# EAGLE design Lattice (EAGLE 6.4)
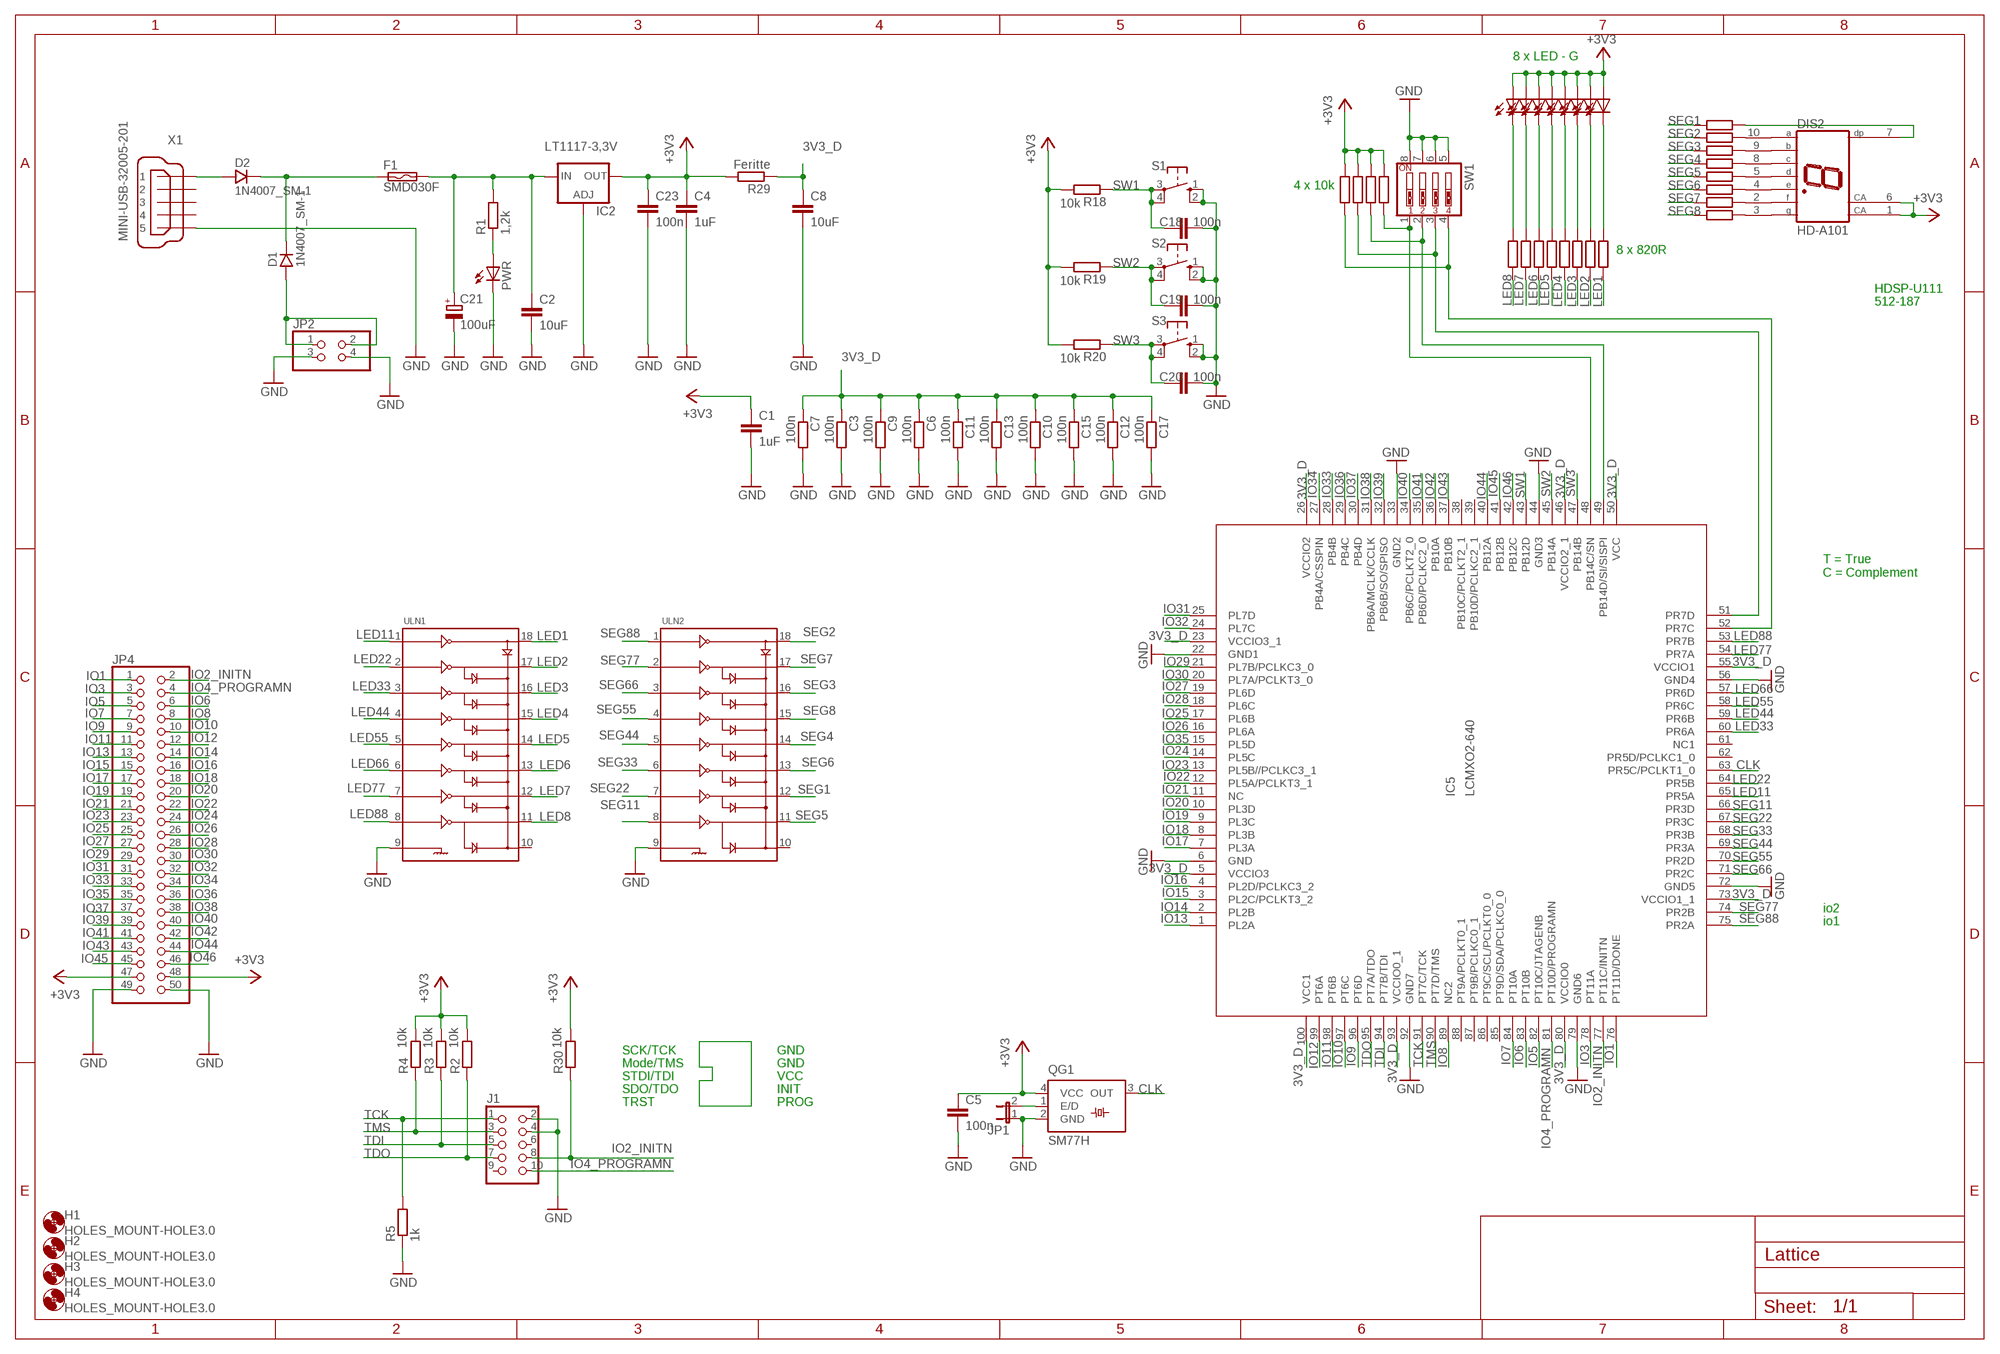
[diagram p0: schematic, sheet 1]

## Parts
C1  1uF  C-EUC1206  [C1206]
C2  10uF  C-EUC1206  [C1206]
C3  100n  R-EU_R0603  [R0603]
C4  1uF  C-EUC1206  [C1206]
C5  100n  C-EUC0805  [C0805]
C6  100n  R-EU_R0603  [R0603]
C7  100n  R-EU_R0603  [R0603]
C8  10uF  C-EUC1206  [C1206]
C9  100n  R-EU_R0603  [R0603]
C10  100n  R-EU_R0603  [R0603]
C11  100n  R-EU_R0603  [R0603]
C12  100n  R-EU_R0603  [R0603]
C13  100n  R-EU_R0603  [R0603]
C15  100n  R-EU_R0603  [R0603]
C17  100n  R-EU_R0603  [R0603]
C18  100n  C-EUC0805  [C0805]
C19  100n  C-EUC0805  [C0805]
C20  100n  C-EUC0805  [C0805]
C21  100uF  CPOL-EU153CLV-0605  [153CLV-0605]
C23  100n  C-EUC0805  [C0805]
D1  1N4007_SM-1  [SM-1]
D2  1N4007_SM-1  [SM-1]
DIS2  HD-A101  [HDSP-A]
F1  SMD030F  [SMD050F]
H1  HOLES_MOUNT-HOLE3.0  [HOLES_3,0]
H2  HOLES_MOUNT-HOLE3.0  [HOLES_3,0]
H3  HOLES_MOUNT-HOLE3.0  [HOLES_3,0]
H4  HOLES_MOUNT-HOLE3.0  [HOLES_3,0]
IC2  LT1117-3,3V  LD117AS50TR  [SOT223]
IC5  LCMXO2-640  LXMXO2-640  [LCMX02-640]
J1  CON_HEADER_2X05-PTH+SHROUDED_A  [PINSHRD_PTH_2X05]
JP1  JP1E  [JP1]
JP2  PINHD-2X2  [2X02]
JP4  PINHD-2X25  [2X25]
LED1  LEDSMT1206  [1206]
LED2  LEDSMT1206  [1206]
LED3  LEDSMT1206  [1206]
LED4  LEDSMT1206  [1206]
LED5  LEDSMT1206  [1206]
LED6  LEDSMT1206  [1206]
LED7  LEDSMT1206  [1206]
LED8  LEDSMT1206  [1206]
PWR  LEDSMT1206  [1206]
QG1  SM77H  [SM77H]
R1  1,2k  R-EU_R0805  [R0805]
R2  10k  R-EU_R0805  [R0805]
R3  10k  R-EU_R0805  [R0805]
R4  10k  R-EU_R0805  [R0805]
R5  1k  R-EU_R0805  [R0805]
R6  R-EU_R0805  [R0805]
R7  R-EU_R0805  [R0805]
R8  R-EU_R0805  [R0805]
R9  R-EU_R0805  [R0805]
R10  R-EU_R0805  [R0805]
R11  R-EU_R0805  [R0805]
R12  R-EU_R0805  [R0805]
R13  R-EU_R0805  [R0805]
R14  R-EU_R0805  [R0805]
R15  R-EU_R0805  [R0805]
R16  R-EU_R0805  [R0805]
R17  R-EU_R0805  [R0805]
R18  10k  R-EU_R0805  [R0805]
R19  10k  R-EU_R0805  [R0805]
R20  10k  R-EU_R0805  [R0805]
R21  R-EU_R0805  [R0805]
R22  R-EU_R0805  [R0805]
R23  R-EU_R0805  [R0805]
R24  R-EU_R0805  [R0805]
R25  R-EU_R0805  [R0805]
R26  R-EU_R0805  [R0805]
R27  R-EU_R0805  [R0805]
R28  R-EU_R0805  [R0805]
R29  Feritte  R-EU_R0805  [R0805]
R30  10k  R-EU_R0805  [R0805]
S1  10-XX  [B3F-10XX]
S2  10-XX  [B3F-10XX]
S3  10-XX  [B3F-10XX]
SW1  SW_DIP-4  [EDG-04]
ULN1  ULN2803SOIC  [SO018]
ULN2  ULN2803SOIC  [SO018]
X1  MINI-USB-32005-201  [32005-201]

## Nets
3V3_D: C3.1 C6.1 C7.1 C8.1 C9.1 C10.1 C11.1 C12.1 C13.1 C15.1 C17.1 IC5.5(VCCIO3) IC5.23(VCCIO3_1) IC5.26(VCCIO2) IC5.46(VCCIO2_1) IC5.50(VCC) IC5.55(VCCIO1) IC5.73(VCCIO1_1) IC5.80(VCCIO0) IC5.93(VCCIO0_1) IC5.100(VCC1) R29.1
+3V3: C1.1 C4.1 C5.1 C23.1 DIS2.1(CA) DIS2.6(CA) IC2.4(OUT) JP4.47 JP4.48 LED1.A LED2.A LED3.A LED4.A LED5.A LED6.A LED7.A LED8.A QG1.4(VCC) R2.2 R3.2 R4.2 R14.1 R15.1 R16.1 R17.1 R18.2 R19.2 R20.2 R29.2 R30.2
CLK: IC5.63(PR5C/PCLKT1_0) QG1.3(OUT)
GND: C1.2 C2.2 C3.2 C4.2 C5.2 C6.2 C7.2 C8.2 C9.2 C10.2 C11.2 C12.2 C13.2 C15.2 C17.2 C18.2 C19.2 C20.2 C21.- C23.2 IC2.1(ADJ) IC5.6(GND) IC5.22(GND1) IC5.33(GND2) IC5.44(GND3) IC5.56(GND4) IC5.72(GND5) IC5.79(GND6) IC5.92(GND7) J1.2 J1.4 JP1.1 JP2.3 JP2.4 JP4.49 JP4.50 PWR.C QG1.2(GND) R5.1 S1.1(S) S1.2(S1) S2.1(S) S2.2(S1) S3.1(S) S3.2(S1) SW1.5 SW1.6 SW1.7 SW1.8 ULN1.9 ULN2.9 X1.5
IO1: IC5.76(PT11D/DONE) JP4.1
IO2_INITN: IC5.77(PT11C/INITN) J1.8 JP4.2 R30.1
IO3: IC5.78(PT11A) JP4.3
IO4_PROGRAMN: IC5.81(PT10D/PROGRAMN) J1.10 JP4.4
IO5: IC5.82(PT10C/JTAGENB) JP4.5
IO6: IC5.83(PT10B) JP4.6
IO7: IC5.84(PT10A) JP4.7
IO8: IC5.89(NC2) JP4.8
IO9: IC5.96(PT6D) JP4.9
IO10: IC5.97(PT6C) JP4.10
IO11: IC5.98(PT6B) JP4.11
IO12: IC5.99(PT6A) JP4.12
IO13: IC5.1(PL2A) JP4.13
IO14: IC5.2(PL2B) JP4.14
IO15: IC5.3(PL2C/PCLKT3_2) JP4.15
IO16: IC5.4(PL2D/PCLKC3_2) JP4.16
IO17: IC5.7(PL3A) JP4.17
IO18: IC5.8(PL3B) JP4.18
IO19: IC5.9(PL3C) JP4.19
IO20: IC5.10(PL3D) JP4.20
IO21: IC5.11(NC) JP4.21
IO22: IC5.12(PL5A/PCLKT3_1) JP4.22
IO23: IC5.13(PL5B//PCLKC3_1) JP4.23
IO24: IC5.14(PL5C) JP4.24
IO25: IC5.17(PL6B) JP4.25
IO26: IC5.16(PL6A) JP4.26
IO27: IC5.19(PL6D) JP4.27
IO28: IC5.18(PL6C) JP4.28
IO29: IC5.21(PL7B/PCLKC3_0) JP4.29
IO30: IC5.20(PL7A/PCLKT3_0) JP4.30
IO31: IC5.25(PL7D) JP4.31
IO32: IC5.24(PL7C) JP4.32
IO33: IC5.28(PB4B) JP4.33
IO34: IC5.27(PB4A/CSSPIN) JP4.34
IO35: IC5.15(PL5D) JP4.35
IO36: IC5.29(PB4C) JP4.36
IO37: IC5.30(PB4D) JP4.37
IO38: IC5.31(PB6A/MCLK/CCLK) JP4.38
IO39: IC5.32(PB6B/SO/SPISO) JP4.39
IO40: IC5.34(PB6C/PCLKT2_0) JP4.40
IO41: IC5.35(PB6D/PCLKC2_0) JP4.41
IO42: IC5.36(PB10A) JP4.42
IO43: IC5.37(PB10B) JP4.43
IO44: IC5.40(PB12A) JP4.44
IO45: IC5.41(PB12B) JP4.45
IO46: IC5.42(PB12C) JP4.46
LED1: R6.1 ULN1.18
LED2: R7.1 ULN1.17
LED3: R8.1 ULN1.16
LED4: R9.1 ULN1.15
LED5: R10.1 ULN1.14
LED6: R11.1 ULN1.13
LED7: R12.1 ULN1.12
LED8: R13.1 ULN1.11
LED11: IC5.65(PR5A) ULN1.1
LED22: IC5.64(PR5B) ULN1.2
LED33: IC5.60(PR6A) ULN1.3
LED44: IC5.59(PR6B) ULN1.4
LED55: IC5.58(PR6C) ULN1.5
LED66: IC5.57(PR6D) ULN1.6
LED77: IC5.54(PR7A) ULN1.7
LED88: IC5.53(PR7B) ULN1.8
N$1: PWR.A R1.1
N$2: C2.1 C21.+ F1.2 IC2.3(IN) R1.2
N$3: JP1.2 QG1.1(E/D)
N$4: IC5.48(PB14C/SN) R14.2 SW1.1
N$5: DIS2.10(A) R22.1
N$8: DIS2.9(B) R23.1
N$9: DIS2.8(C) R24.1
N$10: DIS2.5(D) R25.1
N$11: DIS2.4(E) R26.1
N$12: LED1.C R13.2
N$13: LED2.C R12.2
N$14: LED3.C R11.2
N$15: LED4.C R10.2
N$16: LED5.C R9.2
N$17: LED6.C R8.2
N$18: LED7.C R7.2
N$19: LED8.C R6.2
N$20: DIS2.2(F) R27.1
N$21: IC5.51(PR7D) R16.2 SW1.3
N$22: DIS2.3(G) R28.1
N$23: DIS2.7(DP) R21.1
N$24: IC5.49(PB14D/SI/SISPI) R15.2 SW1.2
N$26: D1.A JP2.1 JP2.2
N$31: IC5.52(PR7C) R17.2 SW1.4
N$42: D1.K D2.K F1.1
N$44: D2.A X1.1
SEG1: R21.2 ULN2.12
SEG2: R22.2 ULN2.18
SEG3: R23.2 ULN2.16
SEG4: R24.2 ULN2.14
SEG5: R25.2 ULN2.11
SEG6: R26.2 ULN2.13
SEG7: R27.2 ULN2.17
SEG8: R28.2 ULN2.15
SEG11: IC5.66(PR3D) ULN2.8
SEG22: IC5.67(PR3C) ULN2.7
SEG33: IC5.68(PR3B) ULN2.6
SEG44: IC5.69(PR3A) ULN2.5
SEG55: IC5.70(PR2D) ULN2.4
SEG66: IC5.71(PR2C) ULN2.3
SEG77: IC5.74(PR2B) ULN2.2
SEG88: IC5.75(PR2A) ULN2.1
SW1: C18.1 IC5.43(PB12D) R18.1 S1.3(P) S1.4(P1)
SW2: C19.1 IC5.45(PB14A) R19.1 S2.3(P) S2.4(P1)
SW3: C20.1 IC5.47(PB14B) R20.1 S3.3(P) S3.4(P1)
TCK: IC5.91(PT7C/TCK) J1.1 R5.2
TDI: IC5.94(PT7B/TDI) J1.5 R3.1
TDO: IC5.95(PT7A/TDO) J1.7 R2.1
TMS: IC5.90(PT7D/TMS) J1.3 R4.1
Unconnected: IC5.38(PB10C/PCLKT2_1) IC5.39(PB10D/PCLKC2_1) IC5.61(NC1) IC5.62(PR5D/PCLKC1_0) IC5.85(PT9D/SDA/PCLKC0_0) IC5.86(PT9C/SCL/PCLKT0_0) IC5.87(PT9B/PCLKC0_1) IC5.88(PT9A/PCLKT0_1) J1.6 J1.9 ULN1.10 ULN2.10 X1.2 X1.3 X1.4

## Notes on the sheet
- 8 x LED - G
- 4 x 10k
- 8 x 820R
- HDSP-U111
- 512-187
- T = True
  C = Complement
- io2
- io1
- SCK/TCK | GND
- Mode/TMS | GND
- STDI/TDI | VCC
- SDO/TDO | INIT
- TRST | PROG

## Library data of the parts
C1 C2 C4 C5 C8 C18-C20 C23 = rcl:C-EU: CAPACITOR, European symbol
C3 C6 C7 C9-C13 C15 C17 = #Odpory:R-EU_: RESISTOR, European symbol
C21 = rcl:CPOL-EU: POLARIZED CAPACITOR, European symbol
D1 D2 = #PaJa_22:1N4007: Usmernovaci dioda - 1A, 1000V
DIS2 = display-hp:HD-A101: LED DISPLAY 1-character 7 segment, decimal point right; OC_FARNELL: unknown; OC_NEWARK: unknown
F1 = switch-raychem:SMD*F: PolySwitch (TM) Resettable Device Source: Data sheet <http://www.farnell.com/datasheets/13482.pdf>
H1-H4 = R-uzky-otoceny:HOLES_MOUNT-HOLE: MOUNTING HOLE with drill center marker
IC2 = v-reg:LD117A?*: Low drop fixed and adjustable positive voltage regulators 1 A Source: http://www.st.com/stonline/products/literature/ds/7194/ld1117axx.pdf
IC5 = lattice:LXMXO2-640
J1 = dp_devices:CON_HEADER_2X05: 2x05 pin header
JP1 = jumper:JP1E: JUMPER
JP2 = pinhead:PINHD-2X2: PIN HEADER
JP4 = pinhead:PINHD-2X25: PIN HEADER
LED1-LED8 PWR = led:LED: LED OSRAM: - CHIPLED LG R971, LG N971, LY N971, LG Q971, LY Q971, LO R971, LY R971 LH N974, LH R974 LS Q976, LO Q976, LY Q976 LO Q996 - Hyper CHIPLED LW Q18S LB Q993, LB Q99A, LB R99A - SideLED LS A670, LO A670, LY A670, LG A670, LP A670 LB A673, LV A673, LT A673, LW A673 LH A674 LY A675 LS A676, LA A676, LO A676, LY A676, LW A676 LS A679, LY A679, LG A679 - Hyper Micro SIDELED® LS Y876, LA Y876, LO Y876, LY Y876 LT Y87S - SmartLED LW L88C, LW L88S LB L89C, LB L89S, LG L890 LS L89K, LO L89K, LY L89K LS L896, LA L896, LO L896, LY L896 - TOPLED LS T670, LO T670, LY T670, LG T670, LP T670 LSG T670, LSP T670, LSY T670, LOP T670, LYG T670 LG T671, LOG T671, LSG T671 LB T673, LV T673, LT T673, LW T673 LH T674 LS T676, LA T676, LO T676, LY T676, LB T676, LH T676, LSB T676, LW T676 LB T67C, LV T67C, LT T67C, LS T67K, LO T67K, LY T67K, LW E67C LS E67B, LA E67B, LO E67B, LY E67B, LB E67C, LV E67C, LT E67C LW T67C LS T679, LY T679, LG T679 LS T770, LO T770, LY T770, LG T770, LP T770 LB T773, LV T773, LT T773, LW T773 LH T774 LS E675, LA E675, LY E675, LS T675 LS T776, LA T776, LO T776, LY T776, LB T776 LHGB T686 LT T68C, LB T68C - Hyper Mini TOPLED® LB M676 - Mini TOPLED Santana® LG M470 LS M47K, LO M47K, LY M47K Source: http://www.osram.convergy.de LUXEON: - LUMILED® LXK2-PW12-R00, LXK2-PW12-S00, LXK2-PW14-U00, LXK2-PW14-V00 LXK2-PM12-R00, LXK2-PM12-S00, LXK2-PM14-U00 LXK2-PE12-Q00, LXK2-PE12-R00, LXK2-PE12-S00, LXK2-PE14-T00, LXK2-PE14-U00 LXK2-PB12-K00, LXK2-PB12-L00, LXK2-PB12-M00, LXK2-PB14-N00, LXK2-PB14-P00, LXK2-PB14-Q00 LXK2-PR12-L00, LXK2-PR12-M00, LXK2-PR14-Q00, LXK2-PR14-R00 LXK2-PD12-Q00, LXK2-PD12-R00, LXK2-PD12-S00 LXK2-PH12-R00, LXK2-PH12-S00 LXK2-PL12-P00, LXK2-PL12-Q00, LXK2-PL12-R00 Source: www.luxeon.com KINGBRIGHT: KA-3528ASYC Source: www.kingbright.com
QG1 = crystal:SM77H: 3.3V CMOS Clock Oscillator Source: www.pletronics.com .. sm77h%203.3v.pdf; OC_FARNELL: unknown; OC_NEWARK: unknown
R1-R30 = rcl:R-EU_: RESISTOR, European symbol
S1-S3 = switch-omron:10-XX: OMRON SWITCH; MPN: B3F-1000; OC_FARNELL: 176432; OC_NEWARK: 36M3542
SW1 = special:SW_DIP-4: DIP SWITCH
ULN1 ULN2 = SparkFun:ULN2803: Darlington Driver ULN2803 Darlington array. 500mA max per channel, 8-channel package. Spark Fun Electronics SKU : COM-00312
X1 = con-cypressindustries:MINI-USB-: MINI USB-B Conector Source: www.cypressindustries.com; OC_FARNELL: unknown; OC_NEWARK: unknown

## Board
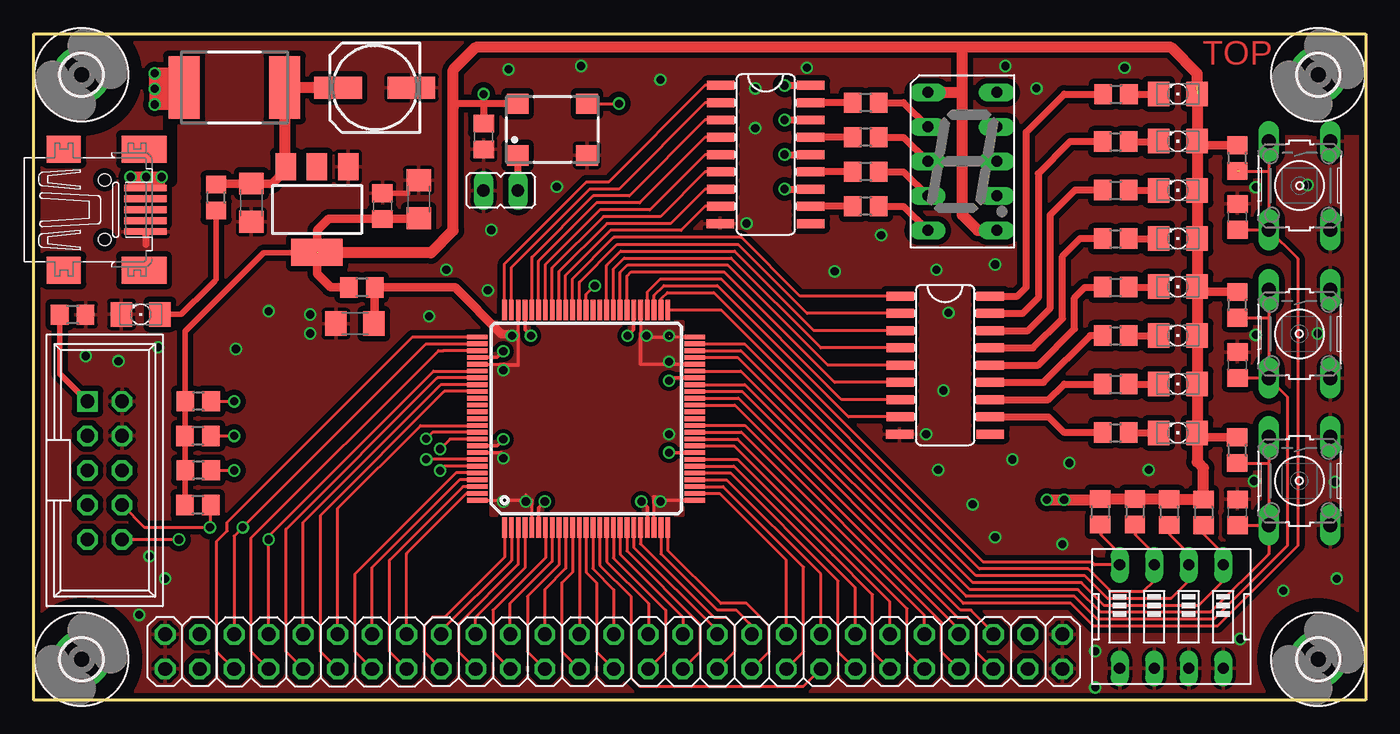
[diagram p1: board, top side]
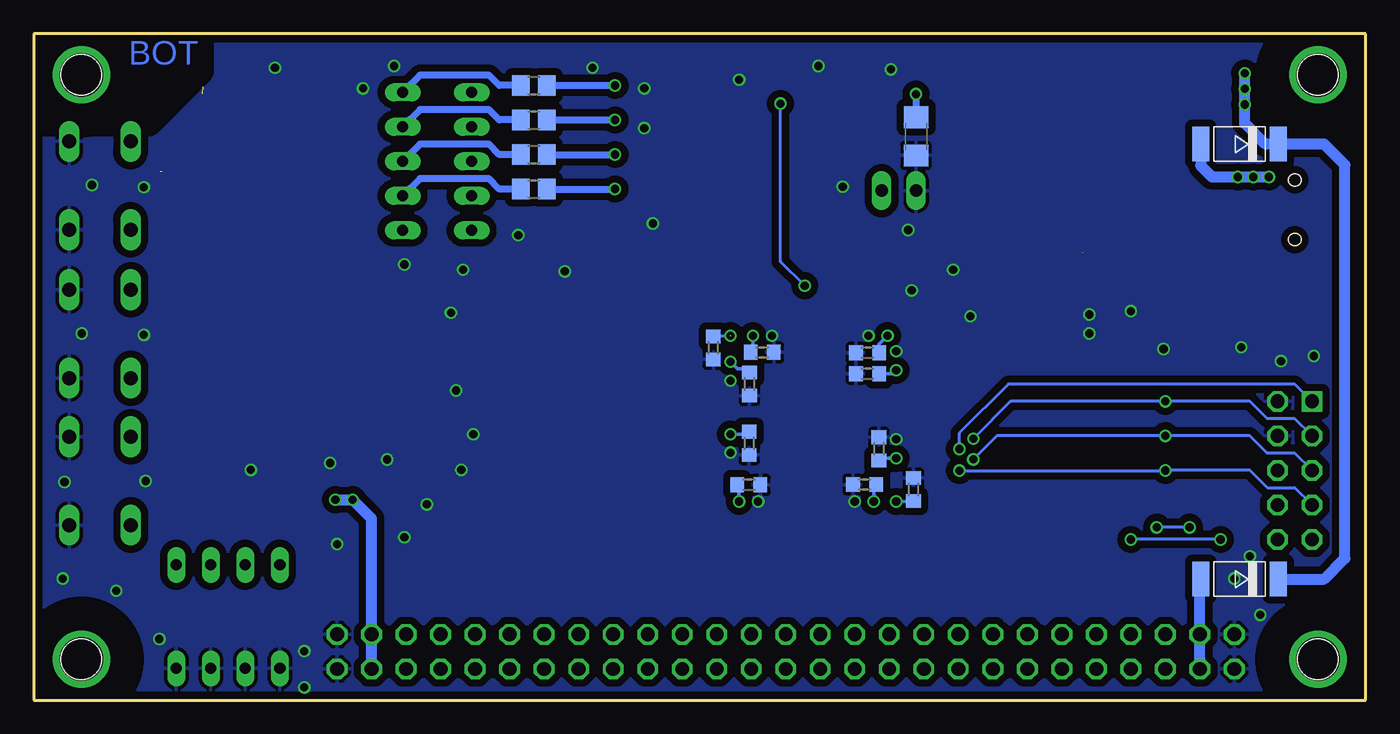
[diagram p2: board, bottom side, seen from below]

Size 98 x 49 mm. Coordinates in mm from the lower left corner, seen from the top.
Outline: 0,0 0,49 98,49 98,0 0,0
Copper layers (1*16): Top 0.035mm / dielectric 1.5mm / Bottom 0.035mm
Design rules "ITEADstudio_DRC": minimum track width 6mil, minimum drill 12mil, track to track 6mil, track to pad 6mil, pad to pad 6mil, via to via 6mil, smd to smd 0mil, copper to edge 10mil, drill to drill 10mil, minimum pad ring 10mil, minimum via ring 6mil, stop-mask expansion 2mil, vias tented up to drill 100mil, thermal gap 10mil
tRestrict: 5 lines
bRestrict: 3 lines

### Footprints (pad centres in the part's own frame; a part is rotated, then mirrored left to right if it is on the bottom)
C1206 = smd 1.6 x 1.8: 1 -1.4,0; 2 1.4,0
R0603 = smd 1 x 1.1: 1 -0.85,0; 2 0.85,0
C0805 = smd 1.3 x 1.5: 1 -0.95,0; 2 0.95,0
153CLV-0605 = smd 3.5 x 1.6: + 2.7,0; - -2.7,0
SM-1 = smd 1.27 x 2.54: A 2.857,0; K -2.857,0
HDSP-A = drill 0.813 long: 1 -2.54,5.08; 2 -2.54,2.54; 3 -2.54,0; 4 -2.54,-2.54; 5 -2.54,-5.08; 6 2.54,-5.08; 7 2.54,-2.54; 8 2.54,0; 9 2.54,2.54; 10 2.54,5.08
SMD050F = smd 2.3 x 4.6: 1 -3.7,0; 2 3.7,0
HOLES_3,0 = hole 3: 0,0
SOT223 = smd 1.5 x 2: 1 -2.3,-3.15; 2 0,-3.15; 3 2.3,-3.15 | smd 3.8 x 2: 4 0,3.15
LCMX02-640 = smd 1.5 x 0.35: 1 -8,6; 2 -8,5.5; 3 -8,5; 4 -8,4.5; 5 -8,4; 6 -8,3.5; 7 -8,3; 8 -8,2.5; 9 -8,2; 10 -8,1.5; 11 -8,1; 12 -8,0.5; 13 -8,0; 14 -8,-0.5; 15 -8,-1; 16 -8,-1.5; 17 -8,-2; 18 -8,-2.5; 19 -8,-3; 20 -8,-3.5; 21 -8,-4; 22 -8,-4.5; 23 -8,-5; 24 -8,-5.5; 25 -8,-6; 51 8,-6; 52 8,-5.5; 53 8,-5; 54 8,-4.5; 55 8,-4; 56 8,-3.5; 57 8,-3; 58 8,-2.5; 59 8,-2; 60 8,-1.5; 61 8,-1; 62 8,-0.5; 63 8,0; 64 8,0.5; 65 8,1; 66 8,1.5; 67 8,2; 68 8,2.5; 69 8,3; 70 8,3.5; 71 8,4; 72 8,4.5; 73 8,5; 74 8,5.5; 75 8,6 | smd 0.35 x 1.5: 26 -6,-8; 27 -5.5,-8; 28 -5,-8; 29 -4.5,-8; 30 -4,-8; 31 -3.5,-8; 32 -3,-8; 33 -2.5,-8; 34 -2,-8; 35 -1.5,-8; 36 -1,-8; 37 -0.5,-8; 38 0,-8; 39 0.5,-8; 40 1,-8; 41 1.5,-8; 42 2,-8; 43 2.5,-8; 44 3,-8; 45 3.5,-8; 46 4,-8; 47 4.5,-8; 48 5,-8; 49 5.5,-8; 50 6,-8; 76 6,8; 77 5.5,8; 78 5,8; 79 4.5,8; 80 4,8; 81 3.5,8; 82 3,8; 83 2.5,8; 84 2,8; 85 1.5,8; 86 1,8; 87 0.5,8; 88 0,8; 89 -0.5,8; 90 -1,8; 91 -1.5,8; 92 -2,8; 93 -2.5,8; 94 -3,8; 95 -3.5,8; 96 -4,8; 97 -4.5,8; 98 -5,8; 99 -5.5,8; 100 -6,8
PINSHRD_PTH_2X05 = drill 1.016 square: 1 -5.08,-1.27 | drill 1.016 octagon: 2 -5.08,1.27; 3 -2.54,-1.27; 4 -2.54,1.27; 5 0,-1.27; 6 0,1.27; 7 2.54,-1.27; 8 2.54,1.27; 9 5.08,-1.27; 10 5.08,1.27
JP1 = drill 0.914 long: 1 0,-1.27; 2 0,1.27
2X02 = drill 1.016 octagon: 1 -1.27,-1.27; 2 -1.27,1.27; 3 1.27,-1.27; 4 1.27,1.27
2X25 = drill 1.016 octagon: 1 -30.48,-1.27; 2 -30.48,1.27; 3 -27.94,-1.27; 4 -27.94,1.27; 5 -25.4,-1.27; 6 -25.4,1.27; 7 -22.86,-1.27; 8 -22.86,1.27; 9 -20.32,-1.27; 10 -20.32,1.27; 11 -17.78,-1.27; 12 -17.78,1.27; 13 -15.24,-1.27; 14 -15.24,1.27; 15 -12.7,-1.27; 16 -12.7,1.27; 17 -10.16,-1.27; 18 -10.16,1.27; 19 -7.62,-1.27; 20 -7.62,1.27; 21 -5.08,-1.27; 22 -5.08,1.27; 23 -2.54,-1.27; 24 -2.54,1.27; 25 0,-1.27; 26 0,1.27; 27 2.54,-1.27; 28 2.54,1.27; 29 5.08,-1.27; 30 5.08,1.27; 31 7.62,-1.27; 32 7.62,1.27; 33 10.16,-1.27; 34 10.16,1.27; 35 12.7,-1.27; 36 12.7,1.27; 37 15.24,-1.27; 38 15.24,1.27; 39 17.78,-1.27; 40 17.78,1.27; 41 20.32,-1.27; 42 20.32,1.27; 43 22.86,-1.27; 44 22.86,1.27; 45 25.4,-1.27; 46 25.4,1.27; 47 27.94,-1.27; 48 27.94,1.27; 49 30.48,-1.27; 50 30.48,1.27
1206 = smd 1.6 x 1.803: A -1.422,0; C 1.422,0
SM77H = smd 1.6 x 1.5: 1 -2.55,-1.9; 2 2.55,-1.9; 3 2.55,1.9; 4 -2.55,1.9
R0805 = smd 1.3 x 1.5: 1 -0.95,0; 2 0.95,0
B3F-10XX = drill 1.016 long: 1 -3.251,2.261; 2 3.251,2.261; 3 -3.251,-2.261; 4 3.251,-2.261
EDG-04 = drill 0.813 long: 1 -3.81,-3.81; 2 -1.27,-3.81; 3 1.27,-3.81; 4 3.81,-3.81; 5 3.81,3.81; 6 1.27,3.81; 7 -1.27,3.81; 8 -3.81,3.81
SO018 = smd 0.66 x 2.032: 1 -5.08,-3.315; 2 -3.81,-3.315; 3 -2.54,-3.315; 4 -1.27,-3.315; 5 0,-3.315; 6 1.27,-3.315; 7 2.54,-3.315; 8 3.81,-3.315; 9 5.08,-3.353; 10 5.08,3.315; 11 3.81,3.315; 12 2.54,3.315; 13 1.27,3.315; 14 0,3.315; 15 -1.27,3.315; 16 -2.54,3.315; 17 -3.81,3.315; 18 -5.08,3.315
32005-201 = smd 3.1 x 0.5: 1 3,1.6; 2 3,0.8; 3 3,0; 4 3,-0.8; 5 3,-1.6 | smd 2.5 x 2: M1 -3,-4.45; M2 -3,4.45 | smd 3.3 x 2: M3 2.9,4.45; M4 2.9,-4.45 | hole 0.9: 0,2.2; 0,-2.2

### Placement (x,y rotation side)
C1  33.08,41.47 270 bottom
C2  16,36.59 270 top
C3  48.01,25.91 270 bottom
C4  28.32,36.85 90 top
C5  33.1,41.46 270 top
C6  35.81,18.48 90 bottom
C7  33.27,15.49 90 bottom
C8  23.62,27.69 180 top
C9  36.87,15.85 180 bottom
C10  36.65,24 180 bottom
C11  45.36,18.89 270 bottom
C12  45.34,23.24 270 bottom
C13  36.65,25.55 180 bottom
C15  45.38,15.83 0 bottom
C17  44.4,25.57 0 bottom
C18  88.58,35.55 90 top
C19  88.57,24.65 90 top
C20  88.57,13.8 90 top
C21  25.09,45.04 180 top
C23  25.65,36.34 90 top
D1  9.27,8.89 180 bottom
D2  9.27,40.89 180 bottom
DIS2  68.33,39.62 0 top
F1  14.75,45.06 0 top
H1  3.51,3 0 top
H2  94.51,3 0 top
H3  94.51,46 0 top
H4  3.51,46 0 top
IC2  20.83,36.08 180 top
IC5  40.64,20.7 90 top
J1  5.21,16.89 270 top
JP1  34.35,37.48 270 top
JP2  10.92,3.56 180 top
JP4  45.21,3.56 0 top
LED1  84.19,19.65 180 top
LED2  84.19,23.25 180 top
LED3  84.19,26.81 180 top
LED4  84.19,30.41 180 top
LED5  84.19,33.95 180 top
LED6  84.19,37.5 180 top
LED7  84.19,41.11 180 top
LED8  84.19,44.59 180 top
PWR  7.86,28.37 180 top
QG1  38.15,41.97 0 top
R1  13.41,36.97 90 top
R2  12.1,16.9 180 top
R3  12.07,19.43 180 top
R4  12.1,21.98 180 top
R5  2.85,28.34 180 top
R6  79.63,44.57 0 top
R7  79.6,41.08 0 top
R8  79.6,37.51 0 top
R9  79.6,33.94 0 top
R10  79.6,30.37 0 top
R11  79.6,26.8 0 top
R12  79.6,23.24 0 top
R13  79.6,19.67 0 top
R14  86.07,13.81 270 top
R15  83.55,13.82 270 top
R16  81.02,13.85 270 top
R17  78.47,13.85 270 top
R18  88.56,39.87 90 top
R19  88.56,29.07 90 top
R20  88.56,18.38 90 top
R21  61.21,37.59 0 bottom
R22  61.21,45.21 0 bottom
R23  61.21,42.67 0 bottom
R24  61.21,40.13 0 bottom
R25  61.21,36.32 180 top
R26  61.21,38.86 180 top
R27  61.21,43.94 180 top
R28  61.21,41.4 180 top
R29  24.13,30.35 180 top
R30  12.06,14.35 180 top
S1  93.15,37.85 270 top
S2  93.14,26.93 270 top
S3  93.14,16.12 270 top
SW1  83.71,6.13 180 top
ULN1  67.06,24.64 270 top
ULN2  53.85,40.13 270 top
X1  5.21,36.07 0 top

### Tracks (layer width: path | path; a pad name or v marks a point on that pad's centre or on a via)
3V3_D  (via drill 0.6)  (1 unrouted)
  Top 0.229: 35.64,29.21 IC5.73 | 46.77,26.7 v46.74,26.8 | 34.77,14.7 v34.54,14.61 | IC5.55 44.64,26.54 | IC5.80 35.58,24.7 35.64,24.77 | IC5.5 36.64,14.67 36.2,15.11 | IC5.23 45.64,14.94 45.59,14.99 45.72,14.99 v46.1,14.61 | IC5.100 35.05,14.7 | IC5.50 46.23,26.7
  Top 0.254: IC5.93 34.42,18.2 34.42,18.16 | 34.54,24.7 34.54,24.64 35.64,24.64 35.64,24.77 35.64,29.21 | IC5.46 44.64,24.7 44.64,26.54 44.64,26.7 46.23,26.7 46.77,26.7 | 45.64,14.7 IC5.26 | 34.77,14.7 35.05,14.7 36.64,14.7
  Top 0.61: v35.18,26.8 35.05,26.92 34.42,26.92 30.99,30.35 R29.1 25.08,27.74 C8.1 25.02,27.94
  Bottom 0.229: 33.49,14.52 C7.1 33.31,14.61 v34.54,14.61 | 46.77,26.76 C3.1
  Bottom 0.254: v34.54,17.78 35.81,17.78 C6.1 | C9.1 36.2,15.85 v36.2,14.61 | v46.1,14.61 46.1,15.83 C15.1 | v46.74,19.56 45.49,19.56 C11.1 | C17.1 45.09,25.57 v45.09,26.8 | v46.74,24.89 46.23,24.38 45.76,24.38 C12.1 | C10.1 34.8,24 v34.54,24.26 | C13.1 35.8,26.17 v35.18,26.8
  pour Top (isolate 0.305): 33.66,13.59 47.75,13.59 47.75,27.81 33.66,27.81
+3V3  (via drill 0.6)  (2 unrouted)
  Top 0.305: C4.1 29.03,35.45
  Top 0.406: 81,14.83 R16.1 | 20.83,32.89 16.89,32.89 11.15,27.15 R4.2 | 68.33,47.88 68.2,48.01 | 68.2,44.7 68.33,44.58 | R4.2 11.15,19.43 11.12,19.41 R3.2 | R4.2 R2.2 11.12,16.9 R30.2 | 30.8,42.29 30.86,43.62 | 20.87,32.89 20.83,32.89 | 20.83,32.77 20.83,32.89 | 35.62,43.76 QG1.4 35.62,43.84
  Top 0.508: 30.91,43.87 30.86,43.81 | C5.1 33.08,42.42 v33.08,44.58 33.08,43.93 33.02,43.87 | QG1.4 33.02,43.87 | 33.02,43.87 31.1,43.87 30.86,43.62
  Top 0.61: C4.1 28.39,35.39 C23.1 21.67,35.39 20.83,34.54 IC2.4 20.83,31.37 21.84,30.35 R29.2 | R20.2 85.94,19.33 LED1.A | R19.2 86,30.02 LED4.A | R18.2 85.9,40.81 LED7.A
  Top 0.813: LED8.A LED7.A LED6.A LED5.A LED4.A LED3.A LED2.A LED1.A 85.61,17.51 86.07,17.05 R14.1 | 20.87,32.89 29.21,32.89 30.86,34.54 30.86,43.62 30.86,43.81 30.86,46.35 32.51,48.01 68.2,48.01 83.69,48.01 85.6,46.1 85.6,45.11 | 68.33,47.88 68.33,44.58 68.33,35.69 69.47,34.54 DIS2.6 | DIS2.1 68.2,44.7 | v74.55,14.73 v75.82,14.73 78.4,14.73 R17.1 R16.1 83.52,14.8 R15.1 86.06,14.77 R14.1 | 86.11,14.79 R14.1
  Bottom 0.229: C1.1 33.08,42.42 C5.1
  Bottom 0.508: v33.08,44.58 C1.1
  Bottom 0.813: JP4.47 JP4.48 73.15,13.34 v74.55,14.73 v75.82,14.73
CLK  (via drill 0.6)
  Top 0.229: QG1.3 v43.05,43.88 | IC5.63 40.64,29.84 v41.27,30.48
  Bottom 0.229: v41.27,30.48 43.05,32.26 v43.05,43.88
GND  (via drill 0.6)
  Top 0.229: C19.2 88.88,25.6
  Top 0.254: IC5.6 37.14,14.15 v37.59,14.61 | IC5.22 45.14,14.17 v44.7,14.61 | IC5.33 v46.74,18.2 | IC5.44 46.94,23.7 v46.74,23.5 | IC5.56 44.14,27.25 v43.69,26.8 | IC5.72 36.14,27.23 v36.58,26.8 | IC5.79 34.09,25.2 v34.54,25.65 | IC5.92 34.07,18.7 v34.54,19.18
  Top 0.406: 27.49,37.29 C23.2 25.07,37.29
  Top 0.508: 8.26,33.53 8.26,34.42
  other vias: 89.79,16.12 89.92,26.86 89.92,37.72 65.66,19.56 52.45,35.05 20.32,28.36 20.32,26.96 3.81,25.31 6.22,24.93 9.14,25.95 8.51,10.58 14.86,25.82 17.27,28.61 29.08,28.23 33.4,30.14 30.35,31.66 38.48,37.76 33.66,34.58 34.92,46.39 40.26,46.65 46.1,45.63 53.09,42.08 53.09,45 56.9,46.52 71.5,46.65 73.79,45 80.26,46.52 70.74,32.04 66.42,31.66 58.93,31.53 62.36,34.2 67.31,28.49 66.93,22.77 66.55,16.93 69.09,14.39 70.74,11.98 75.69,11.47 72.01,17.69 76.2,17.44 82.04,16.93 91.95,8.04 95.89,8.93 78.11,0.93 78.11,3.59 88.77,4.48 93.73,37.88 94.49,26.96 95.76,16.04 7.75,6.26 9.65,8.93
  pour Bottom (isolate 0.533, rank 2): 0,0 0,49 98,49 98,0
  pour Top (isolate 0.406, rank 2): 0,0 0,49 98,49 98,0
IO1
  Top 0.229: JP4.1 13.46,3.56 13.46,11.68 14.22,12.45 14.22,13.08 14.61,13.46 14.86,13.72 27.84,26.7 IC5.76
IO2_INITN  (via drill 0.6)
  Top 0.229: IC5.77 28.87,26.2 v15.37,12.7 14.73,12.06 JP4.2 | J1.8 8.13,12.7 v12.95,12.7 12.95,14.35 R30.1
  Bottom 0.229: v12.95,12.7 v15.37,12.7
IO3
  Top 0.229: JP4.3 16,3.56 16,11.94 29.77,25.7 30.15,25.7 30.73,25.7 IC5.78
IO4_PROGRAMN  (via drill 0.6)
  Top 0.229: JP4.4 v17.27,11.81 17.27,12.06 29.41,24.2 IC5.81 | J1.10 v10.67,11.81
  Bottom 0.229: v10.67,11.81 v17.27,11.81
IO5
  Top 0.229: JP4.5 18.54,3.56 18.54,12.57 29.67,23.7 IC5.82
IO6
  Top 0.229: IC5.83 29.93,23.2 19.81,13.08 JP4.6
IO7
  Top 0.229: JP4.7 21.08,3.56 21.08,13.59 30.19,22.7 IC5.84
IO8
  Top 0.229: JP4.8 22.35,14.1 28.45,20.19 IC5.89
IO9
  Top 0.229: JP4.9 23.62,3.56 23.62,9.27 31.05,16.7 IC5.96
IO10
  Top 0.229: IC5.97 31.31,16.2 24.89,9.78 JP4.10
IO11
  Top 0.229: JP4.11 26.16,3.56 26.16,10.29 31.58,15.7 IC5.98
IO12
  Top 0.229: IC5.99 31.84,15.2 27.43,10.79 JP4.12
IO13
  Top 0.229: JP4.13 28.7,3.56 28.7,5.46 29.34,6.1 30.23,6.1 34.64,10.51 IC5.1
IO14
  Top 0.229: IC5.2 35.14,10.25 29.97,5.08 JP4.14
IO15
  Top 0.229: JP4.15 31.24,3.56 31.24,5.59 35.64,9.99 IC5.3
IO16
  Top 0.229: IC5.4 36.14,9.72 32.51,6.1 JP4.16
IO17
  Top 0.229: JP4.17 33.78,3.56 33.78,6.6 37.64,10.46 IC5.7
IO18
  Top 0.229: JP4.18 35.05,7.11 38.14,10.2 IC5.8
IO19
  Top 0.229: JP4.19 36.32,3.56 36.32,7.62 38.64,9.94 IC5.9
IO20
  Top 0.229: IC5.10 39.14,9.68 37.59,8.13 JP4.20
IO21
  Top 0.229: JP4.21 38.86,3.56 38.86,8.64 39.64,9.41 IC5.11
IO22
  Top 0.229: IC5.12 JP4.22
IO23
  Top 0.229: JP4.23 41.4,3.56 41.4,8.64 40.64,9.4 IC5.13
IO24
  Top 0.229: JP4.24 42.67,8.13 41.14,9.66 IC5.14
IO25
  Top 0.229: JP4.25 46.48,3.56 46.48,6.6 42.64,10.45 IC5.17
IO26
  Top 0.229: IC5.16 42.14,10.18 45.21,7.11 JP4.26
IO27
  Top 0.229: JP4.27 49.02,3.56 49.02,5.59 43.64,10.97 IC5.19
IO28
  Top 0.229: IC5.18 43.14,10.71 47.75,6.1 JP4.28
IO29
  Top 0.229: JP4.29 51.56,3.56 51.56,5.46 50.93,6.1 50.04,6.1 44.64,11.49 IC5.21
IO30
  Top 0.229: IC5.20 44.14,11.23 50.29,5.08 JP4.30
IO31
  Top 0.229: JP4.31 54.1,3.56 54.1,5.46 52.45,7.11 50.55,7.11 46.64,11.02 IC5.25
IO32
  Top 0.229: IC5.24 46.14,10.76 50.29,6.6 51.69,6.6 52.64,5.65 52.7,5.59 52.83,5.46 JP4.32
IO33
  Top 0.229: JP4.33 56.64,3.56 56.64,9.78 50.72,15.7 IC5.28
IO34
  Top 0.229: JP4.34 55.37,10.29 50.46,15.2 IC5.27
IO35
  Top 0.229: IC5.15 41.64,9.92 43.94,7.62 43.94,1.65 44.58,1.02 56.64,1.02 JP4.35
IO36
  Top 0.229: JP4.36 57.91,9.27 50.98,16.2 IC5.29
IO37
  Top 0.229: JP4.37 59.18,3.56 59.18,8.76 51.24,16.7 IC5.30
IO38
  Top 0.229: 60.45,5.08 JP4.38 60.45,8.26 51.51,17.2 IC5.31
IO39
  Top 0.229: JP4.39 61.72,3.56 61.72,7.75 58.8,10.67 58.42,11.05 51.77,17.7 IC5.32
IO40
  Top 0.229: IC5.34 51.53,18.7 62.99,7.24 JP4.40
IO41
  Top 0.229: JP4.41 64.26,3.56 64.26,6.73 51.79,19.2 IC5.35
IO42
  Top 0.229: IC5.36 52.05,19.7 65.53,6.22 JP4.42
IO43
  Top 0.229: JP4.43 66.8,3.56 66.8,5.71 52.32,20.2 IC5.37
IO44
  Top 0.229: IC5.40 51.58,21.7 68.07,5.21 JP4.44
IO45
  Top 0.229: JP4.45 69.34,3.56 69.34,5.46 68.71,6.1 67.94,6.1 51.84,22.2 IC5.41
IO46
  Top 0.229: IC5.42 52.1,22.7 68.2,6.6 68.96,6.6 70.61,4.95 JP4.46
LED1
  Top 0.229: 78.54,44.58 R6.1
  Top 0.508: 78.54,44.58 75.82,44.58 73.03,41.78 73.03,30.35 72.39,29.72 ULN1.18
LED2
  Top 0.508: R7.1 76.25,41.08 73.91,38.73 73.91,29.59 72.77,28.45 ULN1.17
LED3
  Top 0.508: R8.1 76.62,37.51 74.8,35.69 74.8,28.83 73.15,27.18 ULN1.16
LED4
  Top 0.508: R9.1 76.99,33.94 75.69,32.64 75.69,28.07 73.53,25.91 ULN1.15
LED5
  Top 0.229: 78.51,30.35 R10.1
  Top 0.508: 78.51,30.35 77.34,30.35 76.58,29.59 76.58,27.3 73.91,24.64 ULN1.14
LED6
  Top 0.508: R11.1 77.73,26.8 74.3,23.37 ULN1.13
LED7
  Top 0.229: 78.52,23.24 R12.1
  Top 0.508: ULN1.12 74.68,22.1 75.82,23.24 78.52,23.24
LED8
  Top 0.229: 78.53,19.68 R13.1
  Top 0.508: ULN1.11 74.68,20.83 75.84,19.67 R13.1
LED11
  Top 0.229: ULN1.1 56.39,29.72 52.07,34.04 42.67,34.04 39.64,31 IC5.65
LED22
  Top 0.229: IC5.64 40.14,30.74 42.93,33.53 51.82,33.53 56.9,28.45 ULN1.2
LED33
  Top 0.229: ULN1.3 57.4,27.18 51.56,33.02 43.18,33.02 42.14,31.98 IC5.60
LED44
  Top 0.229: ULN1.4 57.91,25.91 51.31,32.51 43.43,32.51 42.64,31.72 IC5.59
LED55
  Top 0.229: ULN1.5 58.42,24.64 51.05,32 43.69,32 43.14,31.46 IC5.58
LED66
  Top 0.229: ULN1.6 58.93,23.37 50.8,31.5 43.94,31.5 43.64,31.19 IC5.57
LED77
  Top 0.229: ULN1.7 59.44,22.1 50.55,30.99 46.1,30.99 45.14,30.03 IC5.54
LED88
  Top 0.229: ULN1.8 59.94,20.83 50.29,30.48 46.35,30.48 45.64,29.77 IC5.53
N$1
  Top 0.406: PWR.A 10.85,28.37 12.89,30.42 13.28,30.81 13.41,30.94 R1.1
N$2
  Top 0.305: 18.4,41.07 18.45,39.37
  Top 0.406: IC2.3 18.53,38.98 | 18.38,39.19 18.45,39.12 | R1.2 13.53,37.92 13.59,37.97 | 15.98,37.97 C2.1
  Top 0.61: 18.45,39.37 18.45,39.31 | 18.45,39.12 18.45,39.31 | 18.45,39.31 IC2.3 | C2.1 17.55,37.99 18.53,38.98 | 18.48,45.04 F1.2 | 13.59,37.97 15.98,37.97
  Top 0.813: F1.2 18.45,39.37 | C21.+ 18.48,45.04
N$3
  Top 0.508: JP1.2 35.62,40.05 QG1.1
N$4
  Top 0.229: R14.2 86.12,12.81 86.12,12.17 87.52,10.78 SW1.1 87.52,8.78 85.72,6.99 78.74,6.99 77.09,8.64 69.09,8.64 52.02,25.7 IC5.48
N$5
  Bottom 0.508: DIS2.10 69.6,45.97 64.52,45.97 63.75,45.21 R22.1
N$8
  Bottom 0.508: DIS2.9 69.6,43.43 64.52,43.43 63.75,42.67 R23.1
N$9
  Bottom 0.508: DIS2.8 69.6,40.89 64.52,40.89 63.75,40.13 R24.1
N$10
  Top 0.508: R25.1 64.01,36.32 DIS2.5
N$11
  Top 0.508: R26.1 64.01,38.86 DIS2.4
N$12
  Top 0.229: 82.77,19.67 LED1.C
  Top 0.508: R13.2 82.77,19.67
N$13
  Top 0.229: 82.77,23.23 LED2.C
  Top 0.508: R12.2 82.77,23.23
N$14
  Top 0.229: LED3.C
  Top 0.508: R11.2 LED3.C
N$15
  Top 0.229: 82.77,30.37 LED4.C
  Top 0.508: R10.2 82.77,30.37
N$16
  Top 0.229: LED5.C
  Top 0.508: R9.2 LED5.C
N$17
  Top 0.229: LED6.C
  Top 0.508: R8.2 LED6.C
N$18
  Top 0.229: 82.77,41.08 LED7.C
  Top 0.508: R7.2 82.77,41.08
N$19
  Top 0.229: 82.77,44.57 LED8.C
  Top 0.508: R6.2 82.77,44.57
N$20
  Top 0.508: R27.1 64.01,43.94 DIS2.2
N$21
  Top 0.229: R16.2 81.04,12.88 81.04,12.17 82.44,10.78 SW1.3 82.44,8.78 81.66,8 79.25,8 77.6,9.65 69.59,9.65 50.55,28.7 | IC5.51 50.55,28.7 | 50.55,28.7
N$22
  Top 0.508: R28.1 64.01,41.4 DIS2.3
N$23
  Bottom 0.508: DIS2.7 69.6,38.35 64.52,38.35 63.75,37.59 R21.1
N$24
  Top 0.229: R15.2 83.58,12.84 83.58,12.17 84.98,10.78 SW1.2 84.98,8.78 83.69,7.49 78.99,7.49 77.34,9.14 69.34,9.14 52.28,26.2 IC5.49
N$26
  Bottom 0.813: JP2.2 JP2.1 12.19,8.83 D1.A
N$27  (via drill 3.2 pad 0.25)
  other vias: 3.5,46
N$28  (via drill 3.2 pad 0.25)
  other vias: 94.5,46
N$29  (via drill 3.2 pad 0.25)
  other vias: 94.5,3
N$30  (via drill 3.2 pad 0.25)
  other vias: 3.5,3
N$31
  Top 0.229: R17.2 78.5,12.86 78.5,12.17 79.9,10.78 SW1.4 78.07,9.94 77.85,10.16 69.85,10.16 50.04,29.97 46.61,29.97 46.14,29.5 IC5.52
N$42  (via drill 0.6)
  Top 0.813: v8.89,44.96 10.95,44.96 F1.1 | v8.89,44.96 v8.89,43.81 10.29,43.81 10.29,46.1 v8.89,46.1 | v8.89,44.96 v8.89,46.1 | v8.89,46.1 9.53,46.1 9.53,43.94
  Bottom 0.813: D1.K 3.05,8.89 1.52,10.41 1.52,39.37 3.05,40.89 D2.K 7.37,40.89 8.89,42.42 v8.89,46.1
N$44  (via drill 0.6)
  Top 0.508: v8.26,38.48 8.26,37.72 X1.1 | v7.11,38.48 7.11,37.72 9.4,37.72 v9.4,38.48 9.02,38.48 9.02,37.97 7.37,37.97
  Top 0.813: v7.11,38.48 v9.4,38.48
  Bottom 0.813: v7.11,38.48 v8.26,38.48 v9.4,38.48 11.3,38.48 12.13,39.31 D2.A
SEG1  (via drill 0.6)
  Top 0.508: v55.24,37.59 ULN2.12
  Bottom 0.508: R21.2 v55.24,37.59
SEG2  (via drill 0.6)
  Top 0.508: v55.24,45.21 ULN2.18
  Bottom 0.508: R22.2 v55.24,45.21
SEG3  (via drill 0.6)
  Top 0.508: v55.24,42.67 ULN2.16
  Bottom 0.508: R23.2 v55.24,42.67
SEG4  (via drill 0.6)
  Top 0.508: v55.24,40.13 ULN2.14
  Bottom 0.508: R24.2 v55.24,40.13
SEG5
  Top 0.508: R25.2 ULN2.11
SEG6
  Top 0.508: R26.2 ULN2.13
SEG7
  Top 0.508: R27.2 ULN2.17
SEG8
  Top 0.508: R28.2 ULN2.15
SEG11
  Top 0.229: ULN2.8 49.4,36.32 47.62,34.54 42.42,34.54 39.14,31.27 IC5.66
SEG22
  Top 0.229: ULN2.7 49.4,37.59 46.86,35.05 42.16,35.05 38.64,31.53 IC5.67
SEG33
  Top 0.229: ULN2.6 49.4,38.86 46.1,35.56 41.91,35.56 38.14,31.79 IC5.68
SEG44
  Top 0.229: ULN2.5 49.4,40.13 45.34,36.07 41.66,36.07 37.64,32.05 IC5.69
SEG55
  Top 0.229: ULN2.4 49.4,41.4 44.58,36.58 41.4,36.58 37.14,32.31 IC5.70
SEG66
  Top 0.229: ULN2.3 49.4,42.67 43.81,37.08 41.15,37.08 36.64,32.58 IC5.71
SEG77
  Top 0.229: ULN2.2 49.4,43.94 43.05,37.59 40.89,37.59 35.14,31.84 IC5.74
SEG88
  Top 0.229: ULN2.1 49.4,45.21 42.29,38.1 40.64,38.1 34.64,32.1 IC5.75
SW1  (1 unrouted)
  Top 0.229: S1.3 90.89,38.91 | 90.89,38.91 S1.4 | C18.1 S1.4 | S1.4 93,32.49 93,11.34 87.12,5.46 77.98,5.46 76.33,7.11 68.4,7.11 52.31,23.2 IC5.43 | 88.71,38.91 90.89,38.91
SW2
  Top 0.229: S2.3 90.88,28.12 | 90.88,28.12 90.88,23.7 | C19.1 90.88,23.7 | 90.88,23.7 S2.4 92.23,22.32 92.23,11.34 86.87,5.97 78.23,5.97 76.58,7.62 68.61,7.62 52.03,24.2 IC5.45 | 88.81,28.12 90.88,28.12
  Top 0.305: R19.1 88.81,28.12
SW3
  Top 0.229: S3.3 90.88,17.43 | 90.88,17.43 S3.4 90.86,12.86 | C20.1 90.86,12.86 | R20.1 90.88,17.43 | IC5.47 51.79,25.2 68.87,8.13 76.83,8.13 78.49,6.48 86.61,6.48 90.86,10.73 90.86,12.86
TCK  (via drill 0.6)
  Top 0.229: IC5.91 30.62,19.2 v29.88,18.47
  Top 0.406: R5.2 1.9,24.01 J1.1
  Bottom 0.229: J1.1 5.21,23.24 26.29,23.24 29.88,19.65 v29.88,18.47
TDI  (via drill 0.6)
  Top 0.229: IC5.94 v28.87,17.7 | R3.1 v14.73,19.43
  Bottom 0.229: J1.5 5.21,18.16 7.24,18.16 8.51,19.43 v14.73,19.43 | v14.73,19.43 27.14,19.43 v28.87,17.7
TDO  (via drill 0.6)
  Top 0.229: R2.1 14.71,16.9 v14.73,16.88 | IC5.95 30.21,17.2 v29.88,16.88
  Bottom 0.229: J1.7 5.21,15.62 7.24,15.62 8.51,16.89 v14.72,16.89 v14.73,16.88 14.8,16.88 v29.88,16.88
TMS  (via drill 0.6)
  Top 0.229: R4.1 14.72,21.98 v14.73,21.97 | IC5.90 29.34,19.7 v28.87,19.23
  Bottom 0.229: J1.3 5.21,20.7 7.24,20.7 8.51,21.97 v14.73,21.97 26.12,21.97 v28.87,19.23

### Text on the board
Top: TOP
Bottom: BOT
_tsilk: M.H. 2014 | GND | CLK1 | OE | CLRN | CLK2 | GLOBAL | CLK3 | LED | DISP | JTAG | 3 | 5 | 11 | 13 | 19 | 21 | 24 | 26 | 30 | 32 | 34 | 36 | 38 | 44 | 46 | 48 | GND | I/O | 2 | 4 | 10 | 12 | 18 | 20 | 22 | 25 | 27 | 31 | 33 | 35 | 37 | 43 | 45 | 47 | GND | GND
_bsilk: 3,3V | 1,8V | 5M80ZE64 | Altera MAX V | CPLD